# Altium project Time-Together-Counter.PrjPcb
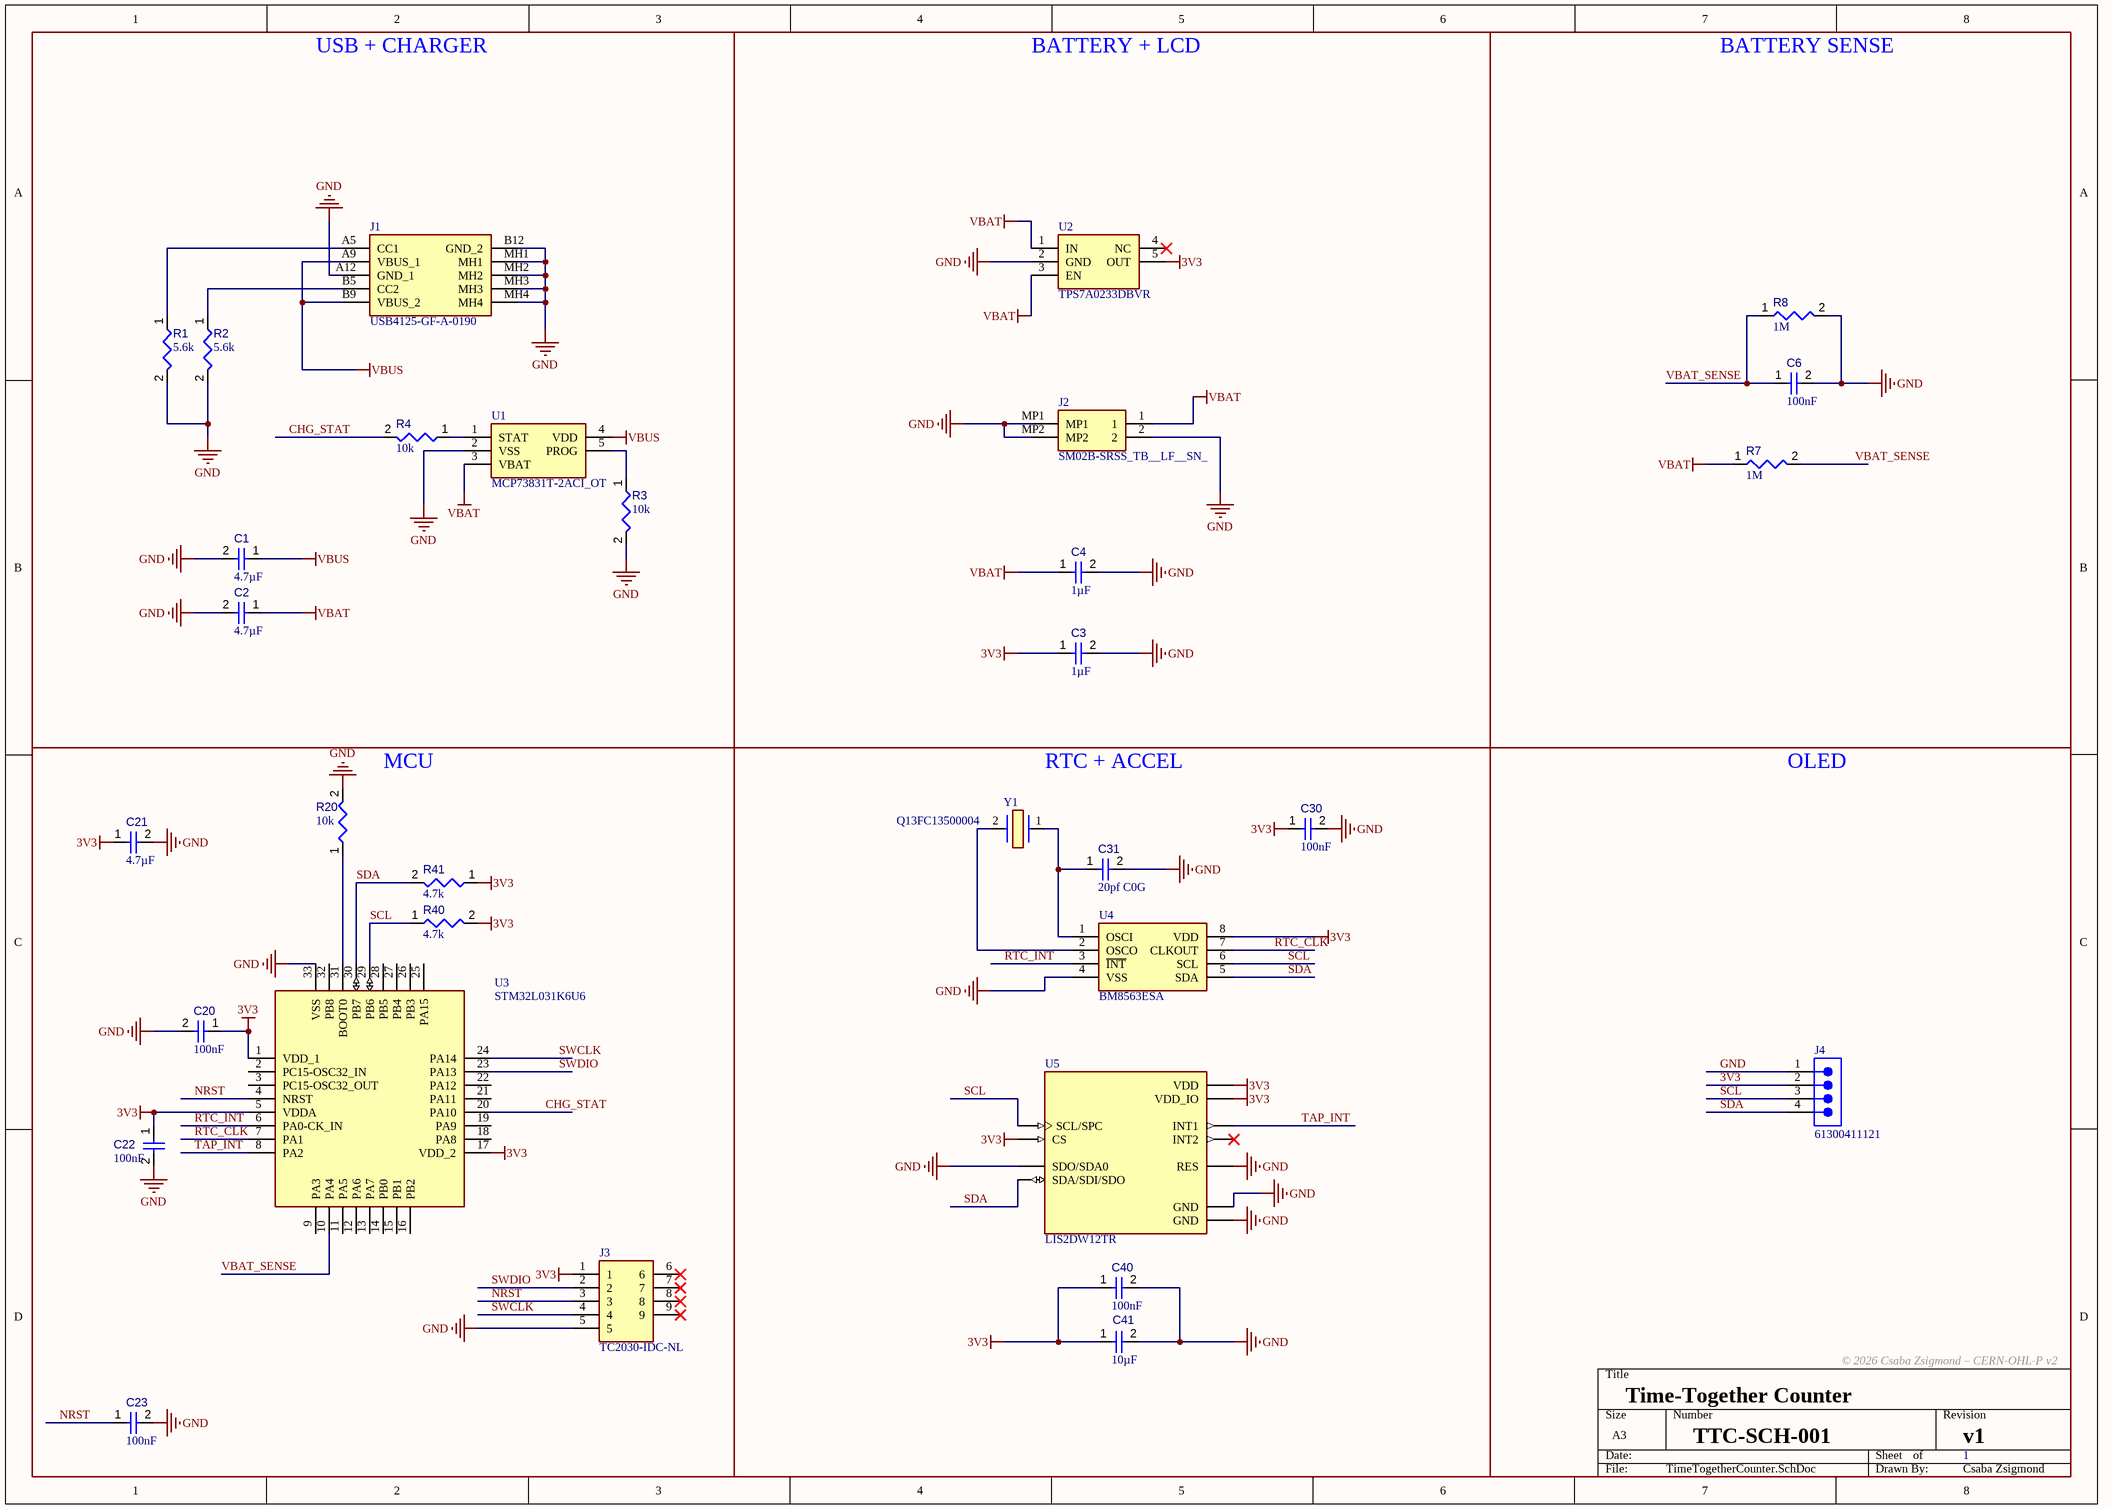
[diagram p0: TimeTogetherCounter.SchDoc]
1 sheet, 32 parts. Net scope: global (net labels, ports and power ports of the same name join across sheets).
Board file: TimeTogetherCounter.PcbDoc

## Sheet TimeTogetherCounter.SchDoc: Time-Together Counter
size A3; Date: 2026-10-05; DrawnBy: Csaba Zsigmond; DocumentNumber: TTC-SCH-001; Revision: v1; SheetNumber: 1; SheetTotal: 1

### Parts
C1  value 4.7µF  [CAPC0603(1608)100_L]  (hidden comment: Capacitor 4.7µF +/-20% 10V 0603)
C2  value 4.7µF  [CAPC0603(1608)100_L]  (hidden comment: Capacitor 4.7µF +/-20% 10V 0603)
C3  value 1µF  [CAPC0402(1005)60_L]  (hidden comment: Capacitor 1µF +/-20% 10V 0402)
C4  value 1µF  [CAPC0402(1005)60_L]  (hidden comment: Capacitor 1µF +/-20% 10V 0402)
C6  value 100nF  [CAPC0402(1005)60_L]  (hidden comment: Capacitor 100nF +/-20% 10V 0402)
C20  value 100nF  [CAPC0402(1005)60_L]  (hidden comment: Capacitor 100nF +/-20% 10V 0402)
C21  value 4.7µF  [CAPC0603(1608)100_L]  (hidden comment: Capacitor 4.7µF +/-20% 10V 0603)
C22  value 100nF  [CAPC0402(1005)60_L]  (hidden comment: Capacitor 100nF +/-20% 10V 0402)
C23  value 100nF  [CAPC0402(1005)60_L]  (hidden comment: Capacitor 100nF +/-20% 10V 0402)
C30  value 100nF  [CAPC0402(1005)60_L]  (hidden comment: Capacitor 100nF +/-20% 10V 0402)
C31  value 20pf C0G  [CAPC0402(1005)60_L]  (hidden comment: Capacitor 100nF +/-20% 10V 0402)
C40  value 100nF  [CAPC0402(1005)60_L]  (hidden comment: Capacitor 100nF +/-20% 10V 0402)
C41  value 10µF  [CAPC0603(1608)100_L]  (hidden comment: Capacitor 10µF +/-20% 10V 0603)
J1  USB4125-GF-A-0190  [USB4125GFA0190]
J2  SM02B-SRSS_TB__LF__SN_  [SM02BSRSSTBLFSN]
J3  TC2030-IDC-NL  [TC2030IDCNL]  (no BOM)
J4  61300411121  [61300411121]  (no BOM)
R1  value 5.6k  [RESC0402(1005)_L]  (hidden comment: 5D6KR2J)
R2  value 5.6k  [RESC0402(1005)_L]  (hidden comment: 5D6KR2J)
R3  value 10k  [RESC0402(1005)_L]  (hidden comment: 10KR2F)
R4  value 10k  [RESC0402(1005)_L]  (hidden comment: 10KR2F)
R7  value 1M  [RESC0402(1005)_L]  (hidden comment: Resistor 1M +/-1 % 0402 63 mW)
R8  value 1M  [RESC0402(1005)_L]  (hidden comment: Resistor 1M +/-1 % 0402 63 mW)
R20  value 10k  [RESC0402(1005)_L]  (hidden comment: 10KR2F)
R40  value 4.7k  [RESC0402(1005)_L]  (hidden comment: 4D7KR2F)
R41  value 4.7k  [RESC0402(1005)_L]  (hidden comment: 4D7KR2F)
U1  MCP73831T-2ACI_OT  [SOT95P270X145-5N]
U2  TPS7A0233DBVR  [SOT95P280X145-5N]
U3  STM32L031K6U6  [QFN50P500X500X60-33N-D]
U4  BM8563ESA  [SOIC127P600X175-8N]
U5  LIS2DW12TR  [LGA12R50P4X4_200X200X70]
Y1  Q13FC13500004  [Q13FC13500004FC13532768KHZ125PF]

### Blocks framed on the sheet
USB + CHARGER: C1 C2 J1 R1-R4 U1
BATTERY + LCD: C3 C4 J2 U2
BATTERY SENSE: C6 R7 R8
MCU: C20-C23 J3 R20 R40 R41 U3
RTC + ACCEL: C30 C31 C40 C41 U4 U5 Y1
OLED: J4

### Nets
3V3: C3.1 C20.1 C21.1 C22.1 C30.1 C40.1 C41.1 J3.1 J4.2 R40.2 R41.1 U2.5(OUT) U3.1(VDD_1) U3.5(VDDA) U3.17(VDD_2) U4.8(VDD) U5.2(CS) U5.9(VDD) U5.10(VDD_IO)
GND: C1.2 C2.2 C3.2 C4.2 C6.2 C20.2 C21.2 C22.2 C23.2 C30.2 C31.2 C40.2 C41.2 J1.A12(GND_1) J1.B12(GND_2) J1.MH1 J1.MH2 J1.MH3 J1.MH4 J2.2 J2.MP1 J2.MP2 J3.5 J4.1 R1.2 R2.2 R3.2 R8.2 R20.2 U1.2(VSS) U2.2(GND) U3.33(VSS) U4.4(VSS) U5.3(SDO/SDA0) U5.6(GND) U5.7(RES) U5.8(GND)
VBAT: C2.1 C4.1 J2.1 R7.1 U1.3(VBAT) U2.1(IN) U2.3(EN)
VBUS: C1.1 J1.A9(VBUS_1) J1.B9(VBUS_2) U1.4(VDD)
CHG_STAT: R4.2 U3.20(PA10)
NRST: C23.1 J3.3 U3.4(NRST)
RTC_CLK: U3.7(PA1) U4.7(CLKOUT)
RTC_INT: U3.6(PA0-CK_IN) U4.3(~{INT})
SCL: J4.3 R40.1 U3.29(PB6) U4.6(SCL) U5.1(SCL/SPC)
SDA: J4.4 R41.2 U3.30(PB7) U4.5(SDA) U5.4(SDA/SDI/SDO)
SWCLK: J3.4 U3.24(PA14)
SWDIO: J3.2 U3.23(PA13)
TAP_INT: U3.8(PA2) U5.12(INT1)
VBAT_SENSE: C6.1 R7.2 R8.1 U3.10(PA4)
NetC31_1: C31.1 U4.1(OSCI) Y1.1
NetJ1_A5: J1.A5(CC1) R1.1
NetJ1_B5: J1.B5(CC2) R2.1
NetR3_1: R3.1 U1.5(PROG)
NetR4_1: R4.1 U1.1(STAT)
NetR20_1: R20.1 U3.31(BOOT0)
NetU4_2: U4.2(OSCO) Y1.2

Not connected (* = marked no-connect by the designer): J3 6* 7* 8* 9*; U2 4(NC)*; U3 2(PC15-OSC32_IN) 3(PC15-OSC32_OUT) 9(PA3) 11(PA5) 12(PA6) 13(PA7) 14(PB0) 15(PB1) 16(PB2) 18(PA8) 19(PA9) 21(PA11) 22(PA12) 25(PA15) 26(PB3) 27(PB4) 28(PB5) 32(PB8); U5 11(INT2)*

### Notes on the sheet
- © 2026 Csaba Zsigmond – CERN-OHL-P v2

### Library data of the parts
C1 C2 C21 = CMP-001-00076-4: Chip Capacitor, 4.7µF +/-20%, 10V, 0603, Thickness 1 mm; Tolerance: 10%; Mounting Technology: SMT; Case/Package: 0603; Pins: 2; Min Operating Temperature: -55°C; Max Operating Temperature: 85°C; Voltage Rating: 10V
C3 C4 = CMP-001-00063-3: Chip Capacitor, 1µF +/-20%, 10V, 0402, Thickness 0.6 mm; Tolerance: 10%; Mounting Technology: SMT; Max Operating Temperature: 85°C; Voltage Rating: 10V; Pins: 2; Case/Package: 0402; Min Operating Temperature: -55°C
C6 C20 C22 C23 C30 C31 C40 = CMP-001-00061-3: Chip Capacitor, 100nF +/-20%, 10V, 0402, Thickness 0.6 mm; Tolerance: 20%; Mounting Technology: SMT; Voltage Rating: 10V; Max Operating Temperature: 85°C; Pins: 2; Case/Package: 0402; Min Operating Temperature: -55°C
C41 = CMP-001-00075-4: Chip Capacitor, 10µF +/-20%, 10V, 0603, Thickness 1 mm; Tolerance: 10%; Voltage Rating: 10V; Max Operating Temperature: 85°C; Pins: 2; Case/Package: 0603; Mounting Technology: SMT; Min Operating Temperature: -55°C
J1 = USB4125-GF-A-0190: Connector; Manufacturer_Name: GCT (GLOBAL CONNECTOR TECHNOLOGY); Datasheet Link: https://eu.mouser.com/datasheet/2/837/usb4125-2448699.pdf; Manufacturer_Part_Number: USB4125-GF-A-0190; Mouser Part Number: 640-USB4125-GF-A-190; Mouser Price/Stock: https://www.mouser.co.uk/ProductDetail/GCT/USB4125-GF-A-0190?qs=QNEnbhJQKvbCz4hEJBS24w%3D%3D
J2 = SM02B-SRSS-TB__LF__SN_: Connector; Manufacturer_Name: JST (JAPAN SOLDERLESS TERMINALS); Manufacturer_Part_Number: SM02B-SRSS-TB (LF)(SN); Datasheet Link: https://www.jst-mfg.com/product/pdf/eng/eSH.pdf; Height: 2.9mm
J3 = TC2030-IDC-NL: Connector; Manufacturer_Name: Tag Connect; Height: 18.669mm; Manufacturer_Part_Number: TC2030-IDC-NL
J4 = CMP-1502-01064-4: THT Vertical Pin Header WR-PHD, Pitch 2.54 mm, Single Row, 4 pins; Connector Type: Male Pin; Gender: Male; Current Rating: 3A; Number of Positions: 4; Operating Supply Voltage: 250V; Contact Resistance: 20mΩ; Pitch: 2.54mm; Max Operating Temperature: 105°C; Mount: Through Hole; Contact Material: Gold; Contact Plating: Gold; Number of Contacts: 4; Orientation: Vertical; Packaging: Bulk; Contact Mating Length: 5.9944mm; Voltage Rating: 250V; Number of Rows: 1; Height: 8.89mm; Lead Free: Lead Free; Lead Pitch: 2.54mm; Number of Pins: 4; Color: Black; Min Operating Temperature: -40°C; RoHS: Compliant; Termination: Solder
R1 R2 = CMP-009-00108-2: 5K6 0.063W 5% 0402 (1005 Metric)  SMD; Power: 63mW; Tolerance: 5%; Case/Package: 0402; Mounting Technology: SMT; Pins: 2
R3 R4 R20 = CMP-009-00066-2: 10K 0.063W 1% 0402 (1005 Metric)  SMD; Power: 63mW; Case/Package: 0402; Mounting Technology: SMT; Pins: 2; Tolerance: 1%
R7 R8 = CMP-009-00165-3: Chip Resistor, 1 MOhms, +/-1 %, 63 mW, -55 to 155 degC, 0402; Tolerance: 1%; Power: 63mW; Case/Package: 0402; Pins: 2
R40 R41 = CMP-009-00105-2: 4K7 0.063W 1% 0402 (1005 Metric)  SMD; Power: 63mW; Mounting Technology: SMT; Case/Package: 0402; Tolerance: 1%; Pins: 2
U1 = MCP73831T-2ACI_OT: Integrated Circuit; Manufacturer_Name: Microchip; Manufacturer_Part_Number: MCP73831T-2ACI/OT; Datasheet Link: http://ww1.microchip.com/downloads/en/DeviceDoc/20001984g.pdf; Height: 1.45mm; Mouser Part Number: 579-MCP73831T-2ACIOT; Mouser Price/Stock: https://www.mouser.co.uk/ProductDetail/Microchip-Technology/MCP73831T-2ACI-OT?qs=yUQqVecv4qvbBQBGbHx0Mw%3D%3D; Arrow Part Number: MCP73831T-2ACI/OT; Arrow Price/Stock: https://www.arrow.com/en/products/mcp73831t-2aci-ot/microchip-technology.html?utm_currency=USD&region=nac
U2 = TPS7A0233DBVR: Integrated Circuit; Manufacturer_Name: Texas Instruments; Datasheet Link: https://www.ti.com/lit/gpn/tps7a02; Height: 1.45mm; Manufacturer_Part_Number: TPS7A0233DBVR; Mouser Part Number: 595-TPS7A0233DBVR; Mouser Price/Stock: https://www.mouser.co.uk/ProductDetail/Texas-Instruments/TPS7A0233DBVR?qs=QNEnbhJQKvZidySW4FDctA%3D%3D; Arrow Part Number: TPS7A0233DBVR; Arrow Price/Stock: https://www.arrow.com/en/products/tps7a0233dbvr/texas-instruments.html?utm_currency=USD&region=nac
U3 = STM32L031K6U6: Integrated Circuit; Manufacturer_Name: STMicroelectronics; Datasheet Link: https://www.st.com/resource/en/datasheet/stm32l031g4.pdf; Height: 0.6mm; Manufacturer_Part_Number: STM32L031K6U6; Mouser Part Number: 511-STM32L031K6U6; Mouser Price/Stock: https://www.mouser.co.uk/ProductDetail/STMicroelectronics/STM32L031K6U6?qs=U58vgkJzipQU%2FBNiv87OVQ%3D%3D; Arrow Part Number: STM32L031K6U6; Arrow Price/Stock: https://www.arrow.com/en/products/stm32l031k6u6/stmicroelectronics?utm_currency=USD&region=nac
U4 = PCF8563T: Integrated Circuit; Manufacturer_Name: NXP; Datasheet Link: https://www.nxp.com/docs/en/data-sheet/PCF8563.pdf; Height: 1.75mm; Manufacturer_Part_Number: PCF8563T; Mouser Part Number: N/A; Mouser Price/Stock: https://www.mouser.co.uk/ProductDetail/NXP-Semiconductors/PCF8563T?qs=F5EMLAvA7IDH70aFPvsqMw%3D%3D
U5 = LIS2DW12TR: Accelerometer X, Y, Z Axis Â±2g, 4g, 8g, 16g 400Hz 12-LGA _2x2_; MF: STMicroelectronics; Value: *; SnapEDA_Link: https://www.snapeda.com/parts/LIS2DW12TR/STMicroelectronics/view-part/621283/?ref=snap; Price: None; Availability: Unavailable; Package: LGA-12 STMicroelectronics; MP: LIS2DW12TR
Y1 = Q13FC13500004_FC-135_32.768KHZ_12.5PF: Crystal or Oscillator; Manufacturer_Name: Epson Timing; Manufacturer_Part_Number: Q13FC13500004 FC-135 32.768KHZ 12.5PF; Datasheet Link: https://support.epson.biz/td/api/doc_check.php?mode=dl&lang=en&Parts=FC-135; Height: 0.9mm